# Altium schematic sheet Power.SchDoc
size A4
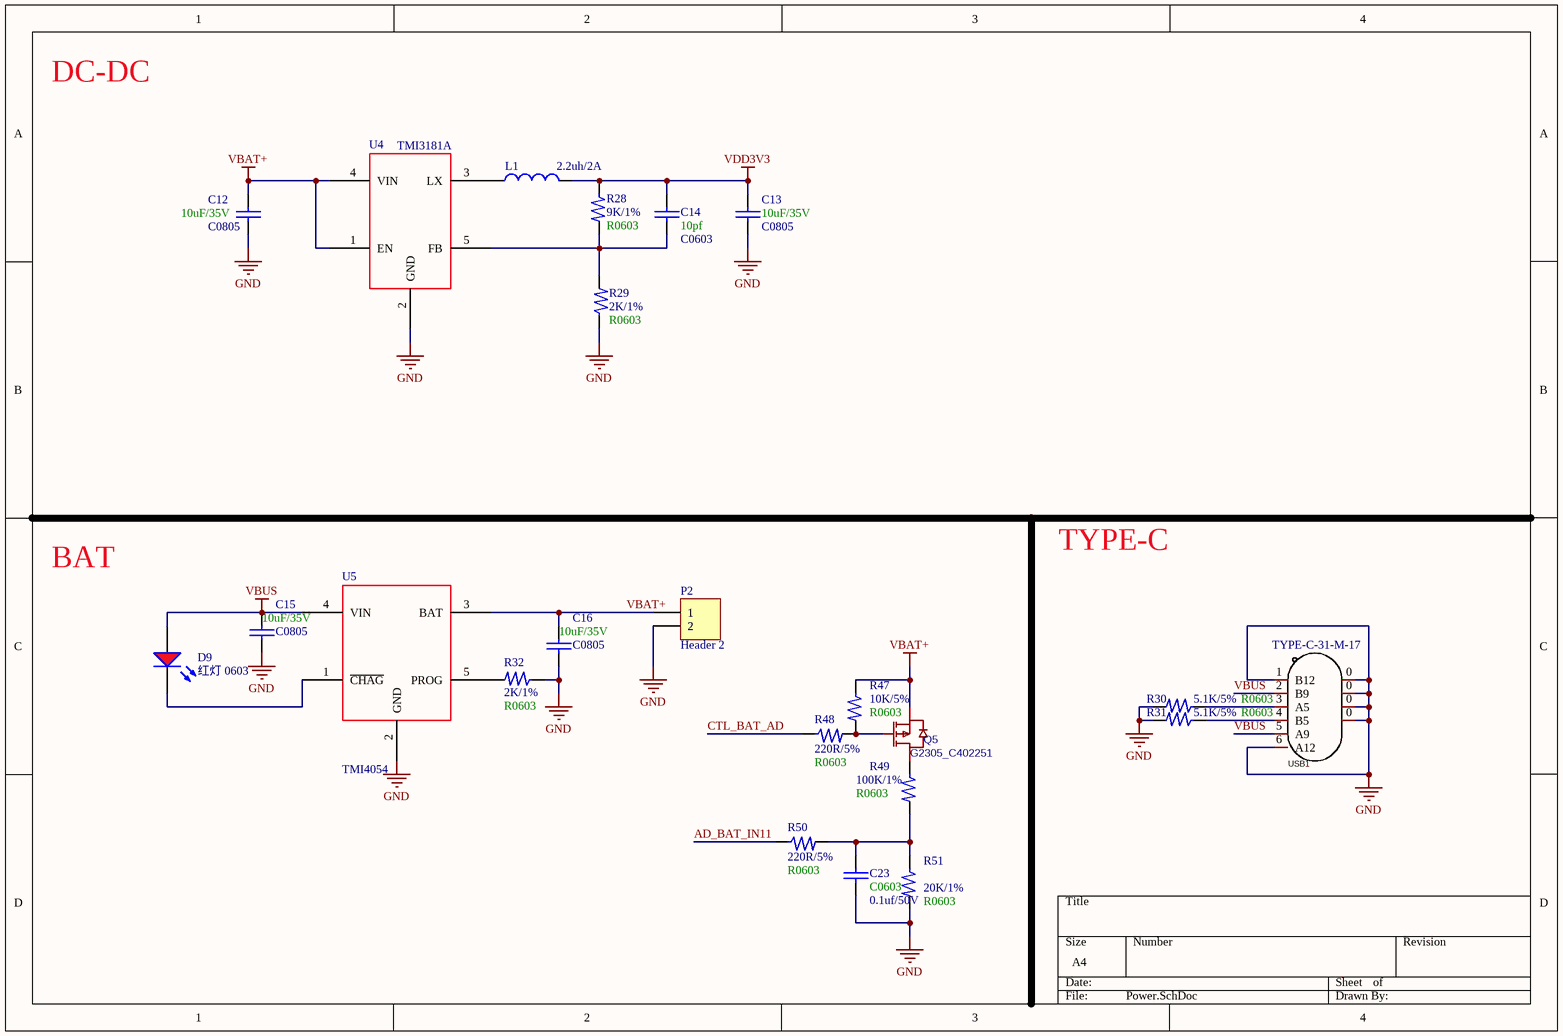
[diagram p0: Power.SchDoc]

## Parts
C12  10uF/35V  value C0805  [0805_C]
C13  10uF/35V  value C0805  [0805_C]
C14  10pf  value C0603  [0603_C]
C15  10uF/35V  value C0805  [0805_C]
C16  10uF/35V  value C0805  [0805_C]
C23  C0603  value 0.1uf/50V  [0603_C]
D9  红灯 0603  [0603_LED_S1]
L1  2.2uh/2A  [IND-SMD_L3.0-W3.0]
P2  Header 2  [CONN-TH_2P-P2.50_XH-2AW]
Q5  G2305_C402251  [SOT-23-3L]
R28  9K/1%  Footprint: R0603  [0603_R]
R29  2K/1%  Footprint: R0603  [0603_R]
R30  5.1K/5%  Footprint: R0603  [0603_R]
R31  5.1K/5%  Footprint: R0603  [0603_R]
R32  2K/1%  Footprint: R0603  [0603_R]
R47  10K/5%  Footprint: R0603  [0603_R]
R48  220R/5%  Footprint: R0603  [0603_R]
R49  100K/1%  Footprint: R0603  [0603_R]
R50  220R/5%  Footprint: R0603  [0603_R]
R51  20K/1%  Footprint: R0603  [0603_R]
U4  TMI3181A  [SOT-23-5]
U5  TMI4054  [SOT-23-5]
USB1  TYPE-C-31-M-17  [USB-C-SMD_10P-P1.00-L6.8-W8.9]

## Nets
GND: C12.2 C13.2 C15.2 C16.2 C23.2 P2.2 R29.2 R30.1 R31.1 R32.2 R51.1 U4.2(GND) U5.2(GND) USB1.0 USB1.1(B12) USB1.6(A12)
VBAT+: C12.1 C16.1 P2.1 Q5.2(S) R47.2 U4.1(EN) U4.4(VIN) U5.3(BAT)
VBUS: C15.1 D9.A U5.4(VIN) USB1.2(B9) USB1.5(A9)
VDD3V3: C13.1 C14.2 L1.1 R28.2
AD_BAT_IN11: R50.2
CTL_BAT_AD: R48.2
NetC14_1: C14.1 R28.1 R29.1 U4.5(FB)
NetC23_1: C23.1 R49.1 R50.1 R51.2
NetD9_K: D9.K U5.1(~{CHAG})
NetL1_2: L1.2 U4.3(LX)
NetQ5_1: Q5.1(G) R47.1 R48.1
NetQ5_3: Q5.3(D) R49.2
NetR30_2: R30.2 USB1.3(A5)
NetR31_2: R31.2 USB1.4(B5)
NetR32_1: R32.1 U5.5(PROG)

## Notes on the sheet
- DC-DC
- BAT
- TYPE-C

## Library data of the parts
C12-C16 = CAP
C23 = CAP: 0.1uf/50V
D9 = 0603 红灯: 发光二极管; ComponentLink1Description: 供应商链接; ComponentLink1URL: http://www.szlcsc.com/product/details_2659.html; Package: 0603; Supplier: LC; SuppliersPartNumber: C2286
L1 = L: Value: *
P2 = Header 2: Header, 2-Pin; LatestRevisionDate: 17-Jul-2002; LatestRevisionNote: Re-released for DXP Platform.; Publisher: Altium Limited
Q5 = G2305_C402251: BOM_Manufacturer: LGE; BOM_Manufacturer Part: G2305; Contributor: LCSC; BOM_Supplier: LCSC; BOM_Supplier Part: C402251; BOM_JLCPCB Part Class: Extended Part; spicePre: Q; spiceSymbolName: G2305_C402251
R28-R32 R47-R51 = 电阻
USB1 = TYPE-C-31-M-17: Manufacturer: 韩国韩荣; Add into BOM: yes; Connector Type: Type-C; Gender: 母座; Number of Contacts: 6; Number of Ports: 1; Name: TYPE-C-31-M-17; Symbol: TYPE-C-31-M-17; Device: TYPE-C-31-M-17; LCSC Part Name: TYPE-C-31-M-17; Supplier Part: C283540; Manufacturer Part: TYPE-C-31-M-17; Supplier Footprint: -; JLCPCB Part Class: Extended Part; Datasheet: https://atta.szlcsc.com/upload/public/pdf/source/20210810/2CA2393895E95C87AA0C31BED5399791.pdf; Supplier: LCSC; Convert to PCB: yes; Standard: -